# Altium schematic sheet Main.SchDoc: IoTBoard
size A; Author: Samson March; DrawnBy: Samson March; DocumentNumber: 1; Revision: 2; SheetNumber: 1; SheetTotal: 6; DocumentName: IoTBoard; ProjectName: IoTBoard
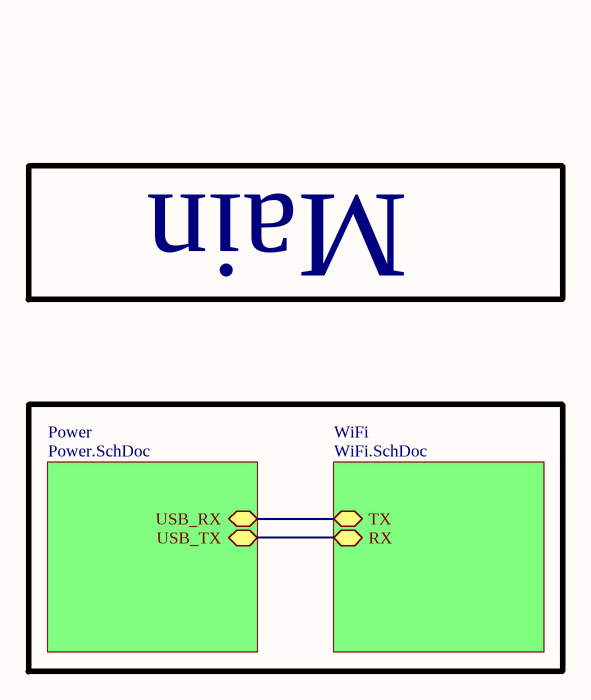
[diagram p0: Main.SchDoc]

## Sub-sheets
Power = Power.SchDoc: USB_TX, USB_RX
WiFi = WiFi.SchDoc: RX, TX

## Nets
(unnamed): sheet Power/USB_TX, sheet WiFi/RX
(unnamed): sheet Power/USB_RX, sheet WiFi/TX

## Notes on the sheet
- Main